# EAGLE schematic Laser Driver LM311 (EAGLE 7.2.0)
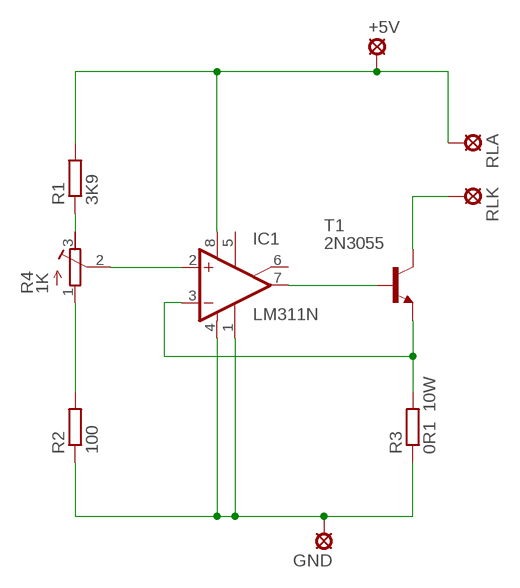
[diagram p0: schematic, sheet 1]

## Parts
+5V  SE14  [SE14]
GND  SE14  [SE14]
IC1  LM311N  [DIL08]
R1  3K9  R-EU_0207/12  [0207/12]
R2  100  R-EU_0207/12  [0207/12]
R3  0R1 10W  R-EU_V235/17  [V235/17]
R4  1K  R-TRIMM3339P  [RTRIM3339P]
RLA  SE14  [SE14]
RLK  SE14  [SE14]
T1  2N3055  [TO3]

## Nets
N$1: +5V.MP IC1.8(V+) R1.2 RLA.MP
N$2: R1.1 R4.3(E)
N$3: R2.2 R4.1(A)
N$4: GND.MP IC1.1(GND) IC1.4(V-) R2.1 R3.1
N$5: IC1.3(-IN) R3.2 T1.E
N$6: IC1.7(OUT) T1.B
N$7: RLK.MP T1.C T1.C/(C)
N$8: IC1.2(+IN) R4.2(S)
Unconnected: IC1.5(ON) IC1.6(ON/STR)

## Library data of the parts
+5V GND RLA RLK = solpad:SE14: SOLDER PAD E1553, drill 1,4mm, distributor Buerklin, 07F820
IC1 = linear:LM311: COMPARATOR
R1 R2 = resistor:R-EU_: RESISTOR, European symbol
R3 = rcl:R-EU_: RESISTOR, European symbol
R4 = resistor:R-TRIMM: Trimm resistor
T1 = transistor:2N3055: NPN TRANSISTOR